# Altium project MainBoard_System.PrjPCB
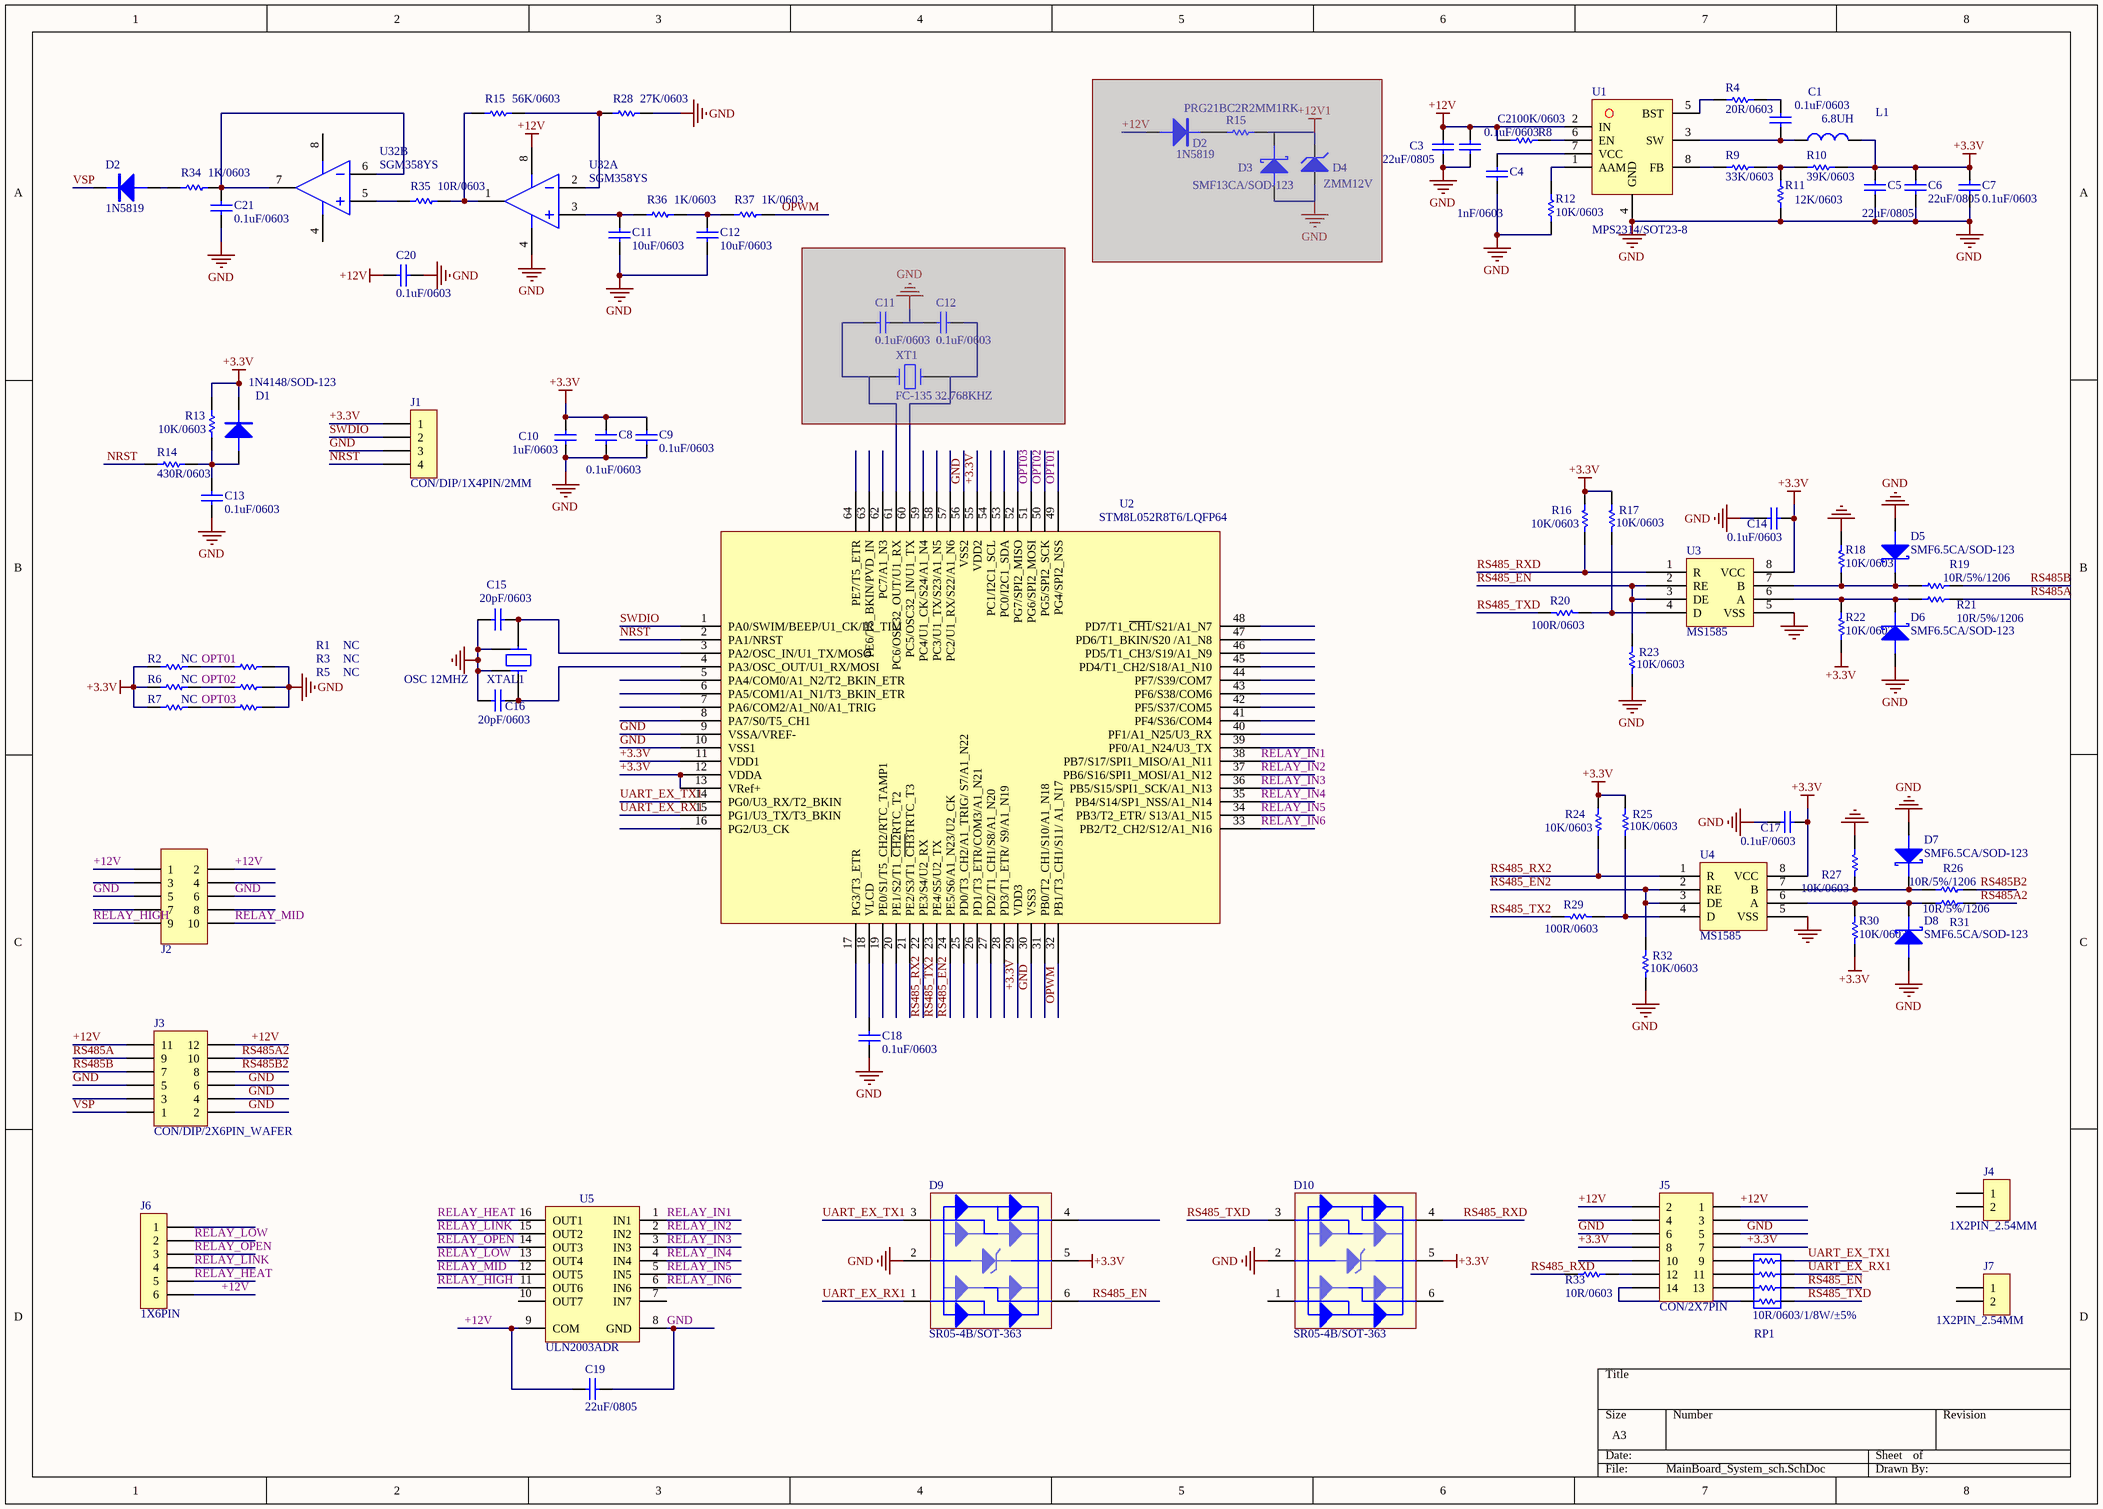
[diagram p0: MainBoard_System_sch.SchDoc]
1 sheet, 89 parts. Net scope: global (net labels, ports and power ports of the same name join across sheets).
Board file: MainBoard_System_pcb.PcbDoc

## Sheet MainBoard_System_sch.SchDoc
size A3

### Parts
(Parts that share a designator on the sheet are numbered #1, #2 ... from top to bottom, then left to right.)
C1  0.1uF/0603  [CAP/SMT/0603C]
C2  0.1uF/0603  [CAP/SMT/0603C]
C3  22uF/0805  [CAP/SMT/0805C]
C4  1nF/0603  [CAP/SMT/0603C]
C5  22uF/0805  [CAP/SMT/0805C]
C6  22uF/0805  [CAP/SMT/0805C]
C7  0.1uF/0603  [CAP/SMT/0603C]
C8  0.1uF/0603  [CAP/SMT/0603C]
C9  0.1uF/0603  [CAP/SMT/0603C]
C10  1uF/0603  [CAP/SMT/0603C]
C11#1  10uF/0603  [CAP/SMT/0603C]
C11#2  0.1uF/0603  [CAP/SMT/0603C]  (masked out: inside a compile mask, not in the netlist)
C12#1  10uF/0603  [CAP/SMT/0603C]
C12#2  0.1uF/0603  [CAP/SMT/0603C]  (masked out: inside a compile mask, not in the netlist)
C13  0.1uF/0603  [CAP/SMT/0603C]
C14  0.1uF/0603  [CAP/SMT/0603C]
C15  20pF/0603  [CAP/SMT/0603C]
C16  20pF/0603  [CAP/SMT/0603C]
C17  0.1uF/0603  [CAP/SMT/0603C]
C18  0.1uF/0603  [CAP/SMT/0603C]
C19  22uF/0805  [CAP/SMT/0805C]
C20  0.1uF/0603  [CAP/SMT/0603C]
C21  0.1uF/0603  [CAP/SMT/0603C]
D1  1N4148/SOD-123  [D/SMT/SOD-123]
D2#1  1N5819  [D/SMT/DO-214AC]  (masked out: inside a compile mask, not in the netlist)
D2#2  1N5819  [D/SMT/DO-214AC]
D3  SMF13CA/SOD-123  [D/SMT/SOD123]  (masked out: inside a compile mask, not in the netlist)
D4  ZMM12V  [D/SMT/SOD-80]  (masked out: inside a compile mask, not in the netlist)
D5  SMF6.5CA/SOD-123  [D/SMT/SOD123]
D6  SMF6.5CA/SOD-123  [D/SMT/SOD123]
D7  SMF6.5CA/SOD-123  [D/SMT/SOD123]
D8  SMF6.5CA/SOD-123  [D/SMT/SOD123]
D9  SR05-4B/SOT-363  [TSOT-6L]
D10  SR05-4B/SOT-363  [TSOT-6L]
J1  CON/DIP/1X4PIN/2MM  [CON/DIP/1×4PIN/2.0MM]
J2  CON/2X5PIN  [CON/DIP/2X5PIN/2.54MM]  (value not drawn)
J3  CON/DIP/2X6PIN_WAFER  [CON/DIP/2X6PIN/2.0MM]
J4  1X2PIN_2.54MM  [CON/DIP/1×2PIN/2.54MM]
J5  CON/2X7PIN  [CON/DIP/2X7PIN/2.0MM]
J6  1X6PIN  [CON/DIP/1×6PIN/2.0MM]
J7  1X2PIN_2.54MM  [CON/DIP/1×2PIN/2.54MM]
L1  6.8UH  [L/SMT/SWPA3015S150MT]
R1  NC  [0603R]
R2  NC  [0603R]
R3  NC  [0603R]
R4  20R/0603  [0603R]
R5  NC  [0603R]
R6  NC  [0603R]
R7  NC  [0603R]
R8  100K/0603  [0603R]
R9  33K/0603  [0603R]
R10  39K/0603  [0603R]
R11  12K/0603  [0603R]
R12  10K/0603  [0603R]
R13  10K/0603  [0603R]
R14  430R/0603  [0603R]
R15#1  56K/0603  [0603R]
R15#2  PRG21BC2R2MM1RK  [0805R]  (masked out: inside a compile mask, not in the netlist)
R16  10K/0603  [0603R]
R17  10K/0603  [0603R]
R18  10K/0603  [0603R]
R19  10R/5%/1206  [1206R]
R20  100R/0603  [0603R]
R21  10R/5%/1206  [1206R]
R22  10K/0603  [0603R]
R23  10K/0603  [0603R]
R24  10K/0603  [0603R]
R25  10K/0603  [0603R]
R26  10R/5%/1206  [1206R]
R27  10K/0603  [0603R]
R28  27K/0603  [0603R]
R29  100R/0603  [0603R]
R30  10K/0603  [0603R]
R31  10R/5%/1206  [1206R]
R32  10K/0603  [0603R]
R33  10R/0603  [0603R]
R34  1K/0603  [0603R]
R35  10R/0603  [0603R]
R36  1K/0603  [0603R]
R37  1K/0603  [0603R]
RP1  10R/0603/1/8W/±5%  [0603R*4]
U1  MPS2314/SOT23-8  [TSOT-8]
U2  STM8L052R8T6/LQFP64  [LQFP64]
U3  MS1585  [SOP-8]
U4  MS1585  [SOP-8]
U5  ULN2003ADR  [SOP-16]
U32  SGM358YS  [SOIC-8]  (parts A,B of 2)
XT1  FC-135 32.768KHZ  [OSC/SMT/32.768KHz]  (masked out: inside a compile mask, not in the netlist)
XTAL1  OSC 12MHZ  [OSC/SMT/12M]

### Nets
+3.3V: C5.2 C6.2 C7.2 C8.2 C9.2 C10.2 C14.2 C17.2 D1.1(K) D9.5 D10.5 J1.1 J5.7 J5.8 L1.2 R2.2 R6.2 R7.2 R10.2 R13.2 R16.2 R17.2 R22.1 R24.2 R25.2 R30.2 U2.11(VDD1) U2.12(VDDA) U2.13(VRef+) U2.29(VDD3) U2.55(VDD2) U3.8(VCC) U4.8(VCC)
+12V: C2.1 C3.2 C19.1 C20.2 J2.1 J2.2 J3.11 J3.12 J5.1 J5.2 J6.6 R8.1 U1.2(IN) U5.9(COM) U32.8(VCC)
GND: C2.2 C3.1 C4.2 C5.1 C6.1 C7.1 C8.1 C9.1 C10.1 C11#1.1 C12#1.1 C13.1 C14.1 C15.2 C16.2 C17.1 C18.1 C19.2 C20.1 C21.2 D5.2(K) D6.2(K) D7.2(K) D8.2(K) D9.2 D10.2 J1.3 J2.5 J2.6 J3.2 J3.4 J3.5 J3.6 J5.5 J5.6 R1.1 R3.1 R5.1 R11.2 R12.1 R18.2 R23.1 R27.1 R28.1 R32.1 U1.4(GND) U2.9(VSSA/VREF-) U2.10(VSS1) U2.30(VSS3) U2.56(VSS2) U3.5(VSS) U4.5(VSS) U5.8(GND) U32.4(GND) XTAL1.2 XTAL1.4
NRST: J1.4 R14.2 U2.2(PA1/NRST)
OPT01: R1.2 R2.1 U2.49(PG4/SPI2_NSS)
OPT02: R3.2 R6.1 U2.50(PG5/SPI2_SCK)
OPT03: R5.2 R7.1 U2.51(PG6/SPI2_MOSI)
OPWM: R37.1 U2.32(PB1/T3_CH1/S11/_A1_N17)
RELAY_HEAT: J6.5 U5.16(OUT1)
RELAY_HIGH: J2.9 U5.11(OUT6)
RELAY_IN1: U2.38(PB7/S17/SPI1_MISO/A1_N11) U5.1(IN1)
RELAY_IN2: U2.37(PB6/S16/SPI1_MOSI/A1_N12) U5.2(IN2)
RELAY_IN3: U2.36(PB5/S15/SPI1_SCK/A1_N13) U5.3(IN3)
RELAY_IN4: U2.35(PB4/S14/SP1_NSS/A1_N14) U5.4(IN4)
RELAY_IN5: U2.34(PB3/T2_ETR/_S13/A1_N15) U5.5(IN5)
RELAY_IN6: U2.33(PB2/T2_CH2/S12/A1_N16) U5.6(IN6)
RELAY_LINK: J6.4 U5.15(OUT2)
RELAY_LOW: J6.2 U5.13(OUT4)
RELAY_MID: J2.10 U5.12(OUT5)
RELAY_OPEN: J6.3 U5.14(OUT3)
RS485_EN: D9.6 R23.2 RP1.2 U3.2(RE) U3.3(DE)
RS485_EN2: R32.2 U2.24(PE5/S6/A1_N23/U2_CK) U4.2(RE) U4.3(DE)
RS485_RX2: R24.1 U2.22(PE3/S4/U2_RX) U4.1(R)
RS485_RXD: D10.4 R16.1 R33.2 U3.1(R)
RS485_TX2: R29.2 U2.23(PE4/S5/U2_TX)
RS485_TXD: D10.3 R20.2 RP1.1
RS485A: J3.9 R21.2
RS485A2: J3.10 R31.2
RS485B: J3.7 R19.2
RS485B2: J3.8 R26.2
SWDIO: J1.2 U2.1(PA0/SWIM/BEEP/U1_CK/IR_TIM)
UART_EX_RX1: D9.1 RP1.3 U2.15(PG1/U3_TX/T3_BKIN)
UART_EX_TX1: D9.3 RP1.4 U2.14(PG0/U3_RX/T2_BKIN)
VSP: D2#2.1(K) J3.1
NetC1_1: C1.1 R4.1
NetC1_2: C1.2 L1.1 U1.3(SW)
NetC4_1: C4.1 U1.7(VCC)
NetC11#1_2: C11#1.2 R36.2 U32.3(IN+)
NetC12#1_2: C12#1.2 R36.1 R37.2
NetC13_2: C13.2 D1.2(A) R13.1 R14.1
NetC15_1: C15.1 U2.3(PA2/OSC_IN/U1_TX/MOSO) XTAL1.3
NetC16_1: C16.1 U2.4(PA3/OSC_OUT/U1_RX/MOSI) XTAL1.1
NetC18_2: C18.2 U2.18(VLCD)
NetC21_1: C21.1 R34.1 U32.6(IN-) U32.7(OUT)
NetD2#2_2: D2#2.2(A) R34.2
NetD5_1: D5.1(A) R18.1 R19.1 U3.7(B)
NetD6_1: D6.1(A) R21.1 R22.2 U3.6(A)
NetD7_1: D7.1(A) R26.1 R27.2 U4.7(B)
NetD8_1: D8.1(A) R30.1 R31.1 U4.6(A)
NetJ5_9: J5.9 RP1.5
NetJ5_11: J5.11 RP1.6
NetJ5_12: J5.12 R33.1
NetJ5_13: J5.13 RP1.7
NetJ5_14: J5.14 RP1.8
NetR4_2: R4.2 U1.5(BST)
NetR8_2: R8.2 U1.6(EN)
NetR9_1: R9.1 U1.8(FB)
NetR9_2: R9.2 R10.1 R11.1
NetR12_2: R12.2 U1.1(AAM)
NetR15#1_1: R15#1.1 R28.2 U32.2(IN-)
NetR15#1_2: R15#1.2 R35.1 U32.1(OUT)
NetR17_1: R17.1 R20.1 U3.4(D)
NetR25_1: R25.1 R29.1 U4.4(D)
NetR35_2: R35.2 U32.5(IN+)

Not connected (* = marked no-connect by the designer): D9 4; D10 1 6; J2 3 4 7 8; J3 3; J4 1 2; J5 3 4 10; J6 1; J7 1 2; U2 5(PA4/COM0/A1_N2/T2_BKIN_ETR) 6(PA5/COM1/A1_N1/T3_BKIN_ETR) 7(PA6/COM2/A1_N0/A1_TRIG) 8(PA7/S0/T5_CH1) 16(PG2/U3_CK) 17(PG3/T3_ETR) 19(PE0/S1/T5_CH2/RTC_TAMP1) 20(PE1/S2/T1_~{CH2}RTC_T2) 21(PE2/S3/T1_~{CH3}TRTC_T3) 25(PD0/T3_CH2/A1_TRIG/_S7/A1_N22) 26(PD1/T3_ETR/COM3/A1_N21) 27(PD2/T1_CH1/S8/A1_N20) 28(PD3/T1_ETR/_S9/A1_N19) 31(PB0/T2_CH1/S10/A1_N18) 39(PF0/A1_N24/U3_TX) 40(PF1/A1_N25/U3_RX) 41(PF4/S36/COM4) 42(PF5/S37/COM5) 43(PF6/S38/COM6) 44(PF7/S39/COM7) 45(PD4/T1_CH2/S18/A1_N10) 46(PD5/T1_CH3/S19/A1_N9) 47(PD6/T1_BKIN/S20_/A1_N8) 48(PD7/T1_~{CH1}/S21/A1_N7) 52(PG7/SPI2_MISO) 53(PC0/I2C1_SDA) 54(PC1/I2C1_SCL) 57(PC2/U1_RX/S22/A1_N6) 58(PC3/U1_TX/S23/A1_N5) 59(PC4/U1_CK/S24/A1_N4) 60(PC5/OSC32_IN/U1_TX) 61(PC6/OSC32_OUT/U1_RX) 62(PC7/A1_N3) 63(PE6/T5_BKIN/PVD_IN) 64(PE7/T5_ETR); U5 7(IN7) 10(OUT7)

### Library data of the parts
C1 C2 C4 C7-C10 C11#1 C11#2 C12#1 C12#2 C13-C18 C20 C21 = CAP/CAP/SMT/0603C
C3 C5 C6 C19 = CAP/CAP/SMT/0805C
D1 = D/D/SMT/1N4148/SOD-123: VR=75V T(-65-175)P(0.5W)VF=0.6V
D2#1 D2#2 = D/D/SMT/1N5819/DO-214
D3 D5-D8 = D/TVS/SMT/SMF13CA/SOD-123
D4 = D/ZENER/SMT/ZMM8V2/SOD80
D9 D10 = D/TVS/SMT/SR05-4B/SOT-363
J1 = CON/DIP/1X4PIN/2MM: Connector
J2 = CON/DIP/2X5PIN: Connector; Manufacturer: Generic Components; Class: Connector
J3 = CON/DIP/2X6PIN_WAFER: Connector; LatestRevisionDate: 17-Jul-2002; LatestRevisionNote: Re-released for DXP Platform.; Publisher: Altium Limited
J4 J7 = CON/DIP/1X2PIN_2.54MM: Connector
J5 = CON/DIP/2X7PIN
J6 = CON/DIP/1X6PIN_2MM: Connector
L1 = L/L/SMT/SWPA3015S150MT: 电感3.0MM*3.0MM*1.5MM
R1-R14 R15#1 R28 R33-R37 = RES/RES/SMT/0603
R15#2 = RES/RES/SMT/0805
R16-R18 R20 R22-R25 R27 R29 R30 R32 = Res1: Resistor; Manufacturer: Generic Components; Class: Passive; Value: 1K; Published: 08/06/2000; Publisher: Altium Hobart Technology Centre; SubClass: Resistor
R19 R21 R26 R31 = RES/RES/SMT/1206
RP1 = RES /PACKS/SMT/0603*4: Isolated Resistor Network; Value: 1K; Published: 24-Mar-1999; LatestRevisionDate: 29-May-2009; LatestRevisionNote: IPC-7351 Footprint Added.; PackageReference: SO-16; Publisher: Altium Limited; PackageDescription: 16-Pin Small Outline Integrated Circuit 1.27 mm Pitch; Code_JEDEC: MS-012-AC; Code_IPC: SOIC127P600-16
U1 = IC/POWER/SMT/MPS2314/SOT23-8
U2 = MCU/SMT/STM8L052R8T6/LQFP64
U3 U4 = MAX487
U5 = IC/DRIVE/SMT/ULN2003ADR/SOIC-16: High-Voltage, High-Current Darlington Array; Published: 13-Oct-2000; LatestRevisionDate: 13-Apr-2006; LatestRevisionNote: IPC-7351 Footprint Added.; DatasheetVersion: 1998; PackageReference: L16; Publisher: Altium Limited; PackageDescription: 16-Pin Small Outline Integrated Circuit 1.27 mm Pitch; Code_JEDEC: MS-012-AC; Code_IPC: SOIC127P600-16; ComponentLink1Description: Manufacturer Link; ComponentLink1URL: http://www.allegromicro.com/
U32 = IC/OP/SMT/SGM358YS/SOIC-8: 1MHz 60uA Rail-to-Rail i/o CMOS OP; Manufacturer: ST-Microelectronics; Class: Analog; SubClass: Comparator; Published: 24/08/2001; Publisher: Altium Hobart Technology Centre
XT1 = XTAL/SMT/FC-135 32.768KHZ
XTAL1 = XTAL/SMT/OSC12MHZ-2